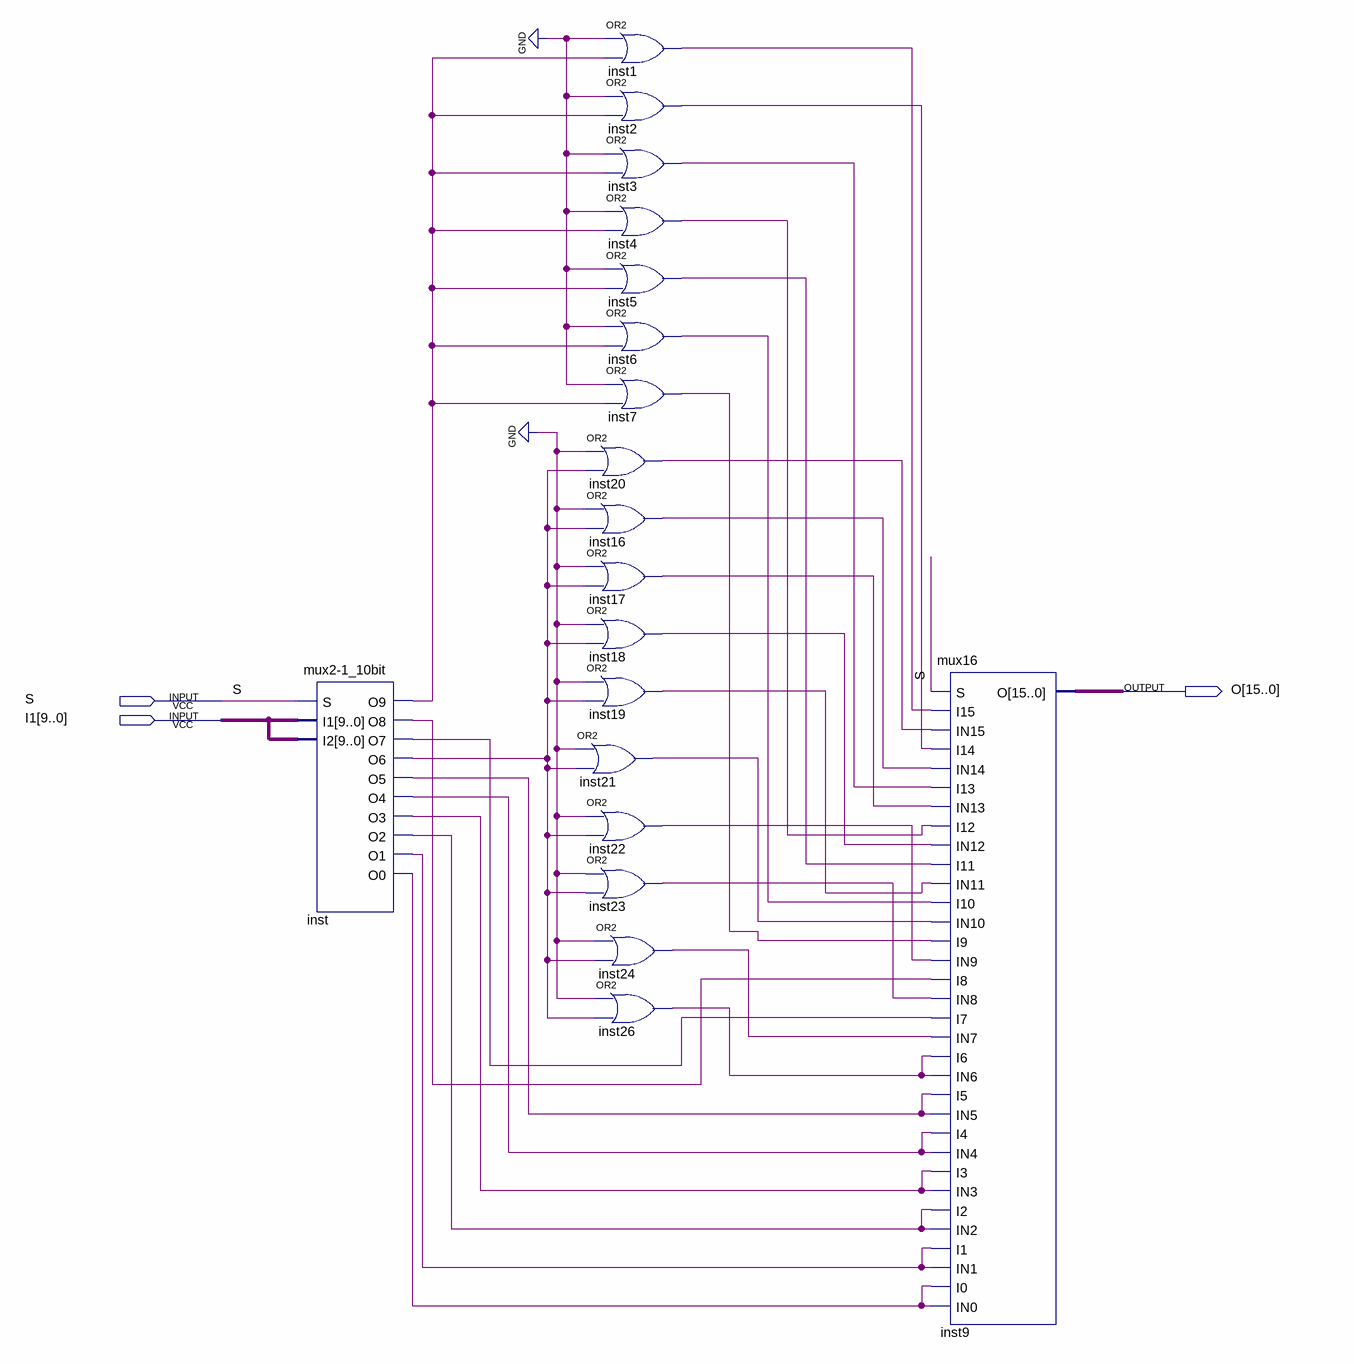
[diagram p0: schematic sheet]
// Quartus schematic sign_extend.bdf as structural Verilog: 19 symbols, 3 pins
module sign_extend (
  input  S,
  input  [9:0] I1,
  output [15:0] O
);

  wire inst1_out, inst2_out, inst3_out, inst4_out, inst5_out, inst6_out, inst7_out, inst16_out, inst17_out,
       inst18_out, inst19_out, inst20_out, inst21_out, inst22_out, inst23_out, inst24_out, inst26_out,
       inst_o0, inst_o1, inst_o2, inst_o3, inst_o4, inst_o5, inst_o6, inst_o7, inst_o8, inst_o9;

  \mux2-1_10bit  inst (
    .S(S), .I1(I1), .I2(I1), .O9(inst_o9), .O8(inst_o8), .O7(inst_o7), .O6(inst_o6), .O5(inst_o5),
    .O4(inst_o4), .O3(inst_o3), .O2(inst_o2), .O1(inst_o1), .O0(inst_o0));
  or inst1 (inst1_out, 1'b0, inst_o9);
  or inst2 (inst2_out, 1'b0, inst_o9);
  or inst3 (inst3_out, 1'b0, inst_o9);
  or inst4 (inst4_out, 1'b0, inst_o9);
  or inst5 (inst5_out, 1'b0, inst_o9);
  or inst6 (inst6_out, 1'b0, inst_o9);
  or inst7 (inst7_out, 1'b0, inst_o9);
  or inst20 (inst20_out, 1'b0, inst_o6);
  or inst16 (inst16_out, 1'b0, inst_o6);
  or inst17 (inst17_out, 1'b0, inst_o6);
  or inst18 (inst18_out, 1'b0, inst_o6);
  or inst19 (inst19_out, 1'b0, inst_o6);
  or inst21 (inst21_out, 1'b0, inst_o6);
  or inst22 (inst22_out, 1'b0, inst_o6);
  or inst23 (inst23_out, 1'b0, inst_o6);
  or inst24 (inst24_out, 1'b0, inst_o6);
  or inst26 (inst26_out, 1'b0, inst_o6);
  mux16 inst9 (
    .S(S), .I15(inst1_out), .IN15(inst20_out), .I14(inst2_out), .IN14(inst16_out), .I13(inst3_out),
    .IN13(inst17_out), .I12(inst4_out), .IN12(inst18_out), .I11(inst5_out), .IN11(inst19_out),
    .I10(inst6_out), .IN10(inst21_out), .I9(inst7_out), .IN9(inst22_out), .I8(inst_o8), .IN8(inst23_out),
    .I7(inst_o7), .IN7(inst24_out), .I6(inst26_out), .IN6(inst26_out), .I5(inst_o5), .IN5(inst_o5),
    .I4(inst_o4), .IN4(inst_o4), .I3(inst_o3), .IN3(inst_o3), .I2(inst_o2), .IN2(inst_o2), .I1(inst_o1),
    .IN1(inst_o1), .I0(inst_o0), .IN0(inst_o0), .O(O));
endmodule
